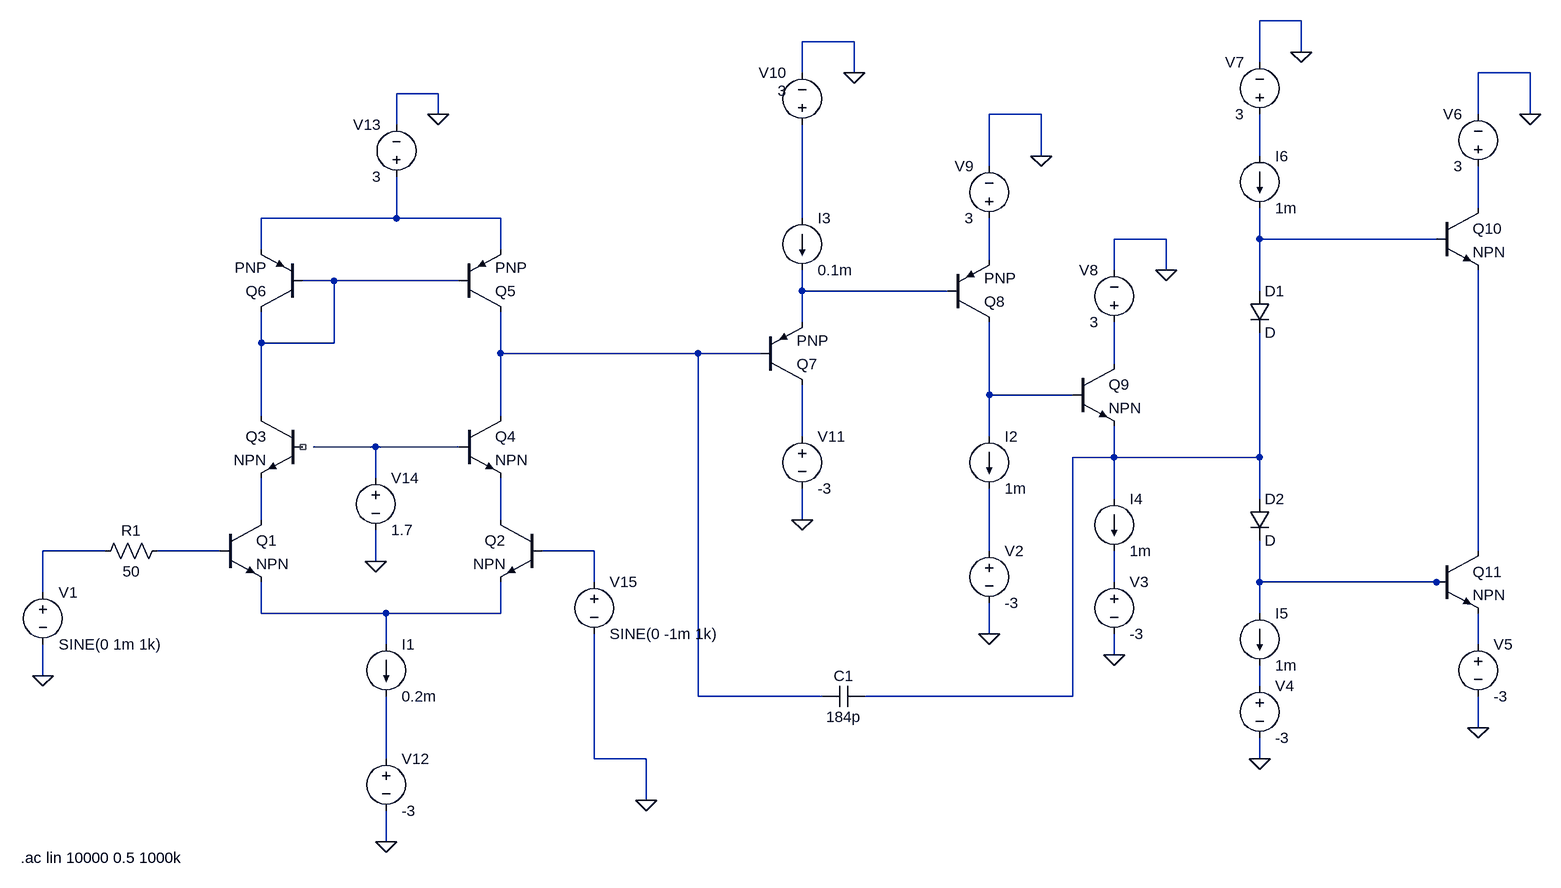
[diagram p0: schematic project.asc]
project.asc, the LTspice schematic file:
Version 4
SHEET 1 2212 680
WIRE 1680 -656 1616 -656
WIRE 992 -624 912 -624
WIRE 1680 -608 1680 -656
WIRE 1616 -592 1616 -656
WIRE 912 -576 912 -624
WIRE 992 -576 992 -624
WIRE 2032 -576 1952 -576
WIRE 352 -544 288 -544
WIRE 352 -512 352 -544
WIRE 1280 -512 1200 -512
WIRE 1952 -512 1952 -576
WIRE 2032 -512 2032 -576
WIRE 288 -496 288 -544
WIRE 1280 -448 1280 -512
WIRE 1616 -448 1616 -512
WIRE 1200 -432 1200 -512
WIRE 1952 -368 1952 -432
WIRE 288 -352 288 -416
WIRE 288 -352 80 -352
WIRE 448 -352 288 -352
WIRE 912 -352 912 -496
WIRE 1472 -320 1392 -320
WIRE 1616 -320 1616 -368
WIRE 1888 -320 1616 -320
WIRE 80 -304 80 -352
WIRE 448 -304 448 -352
WIRE 1200 -288 1200 -352
WIRE 1392 -272 1392 -320
WIRE 1472 -272 1472 -320
WIRE 192 -256 144 -256
WIRE 384 -256 192 -256
WIRE 912 -240 912 -272
WIRE 1136 -240 912 -240
WIRE 1616 -240 1616 -320
WIRE 912 -192 912 -240
WIRE 80 -160 80 -208
WIRE 192 -160 192 -256
WIRE 192 -160 80 -160
WIRE 448 -144 448 -208
WIRE 752 -144 448 -144
WIRE 848 -144 752 -144
WIRE 1392 -128 1392 -192
WIRE 1200 -80 1200 -192
WIRE 1328 -80 1200 -80
WIRE 80 -48 80 -160
WIRE 448 -48 448 -144
WIRE 912 -16 912 -96
WIRE 1200 -16 1200 -80
WIRE 256 0 160 0
WIRE 384 0 256 0
WIRE 1392 16 1392 -32
WIRE 1392 16 1328 16
WIRE 1616 16 1616 -176
WIRE 1616 16 1392 16
WIRE 256 48 256 0
WIRE 1392 80 1392 16
WIRE 1616 80 1616 16
WIRE 80 112 80 48
WIRE 448 112 448 48
WIRE 912 112 912 64
WIRE -160 160 -256 160
WIRE 16 160 -80 160
WIRE 592 160 512 160
WIRE 1200 160 1200 64
WIRE 1952 160 1952 -272
WIRE 256 176 256 128
WIRE 592 208 592 160
WIRE 1392 208 1392 160
WIRE 1616 208 1616 144
WIRE 1888 208 1616 208
WIRE 1904 208 1888 208
WIRE -256 224 -256 160
WIRE 80 256 80 208
WIRE 272 256 80 256
WIRE 448 256 448 208
WIRE 448 256 272 256
WIRE 1616 256 1616 208
WIRE 1200 288 1200 240
WIRE 272 304 272 256
WIRE 1952 304 1952 256
WIRE 1392 320 1392 288
WIRE -256 352 -256 304
WIRE 1616 368 1616 336
WIRE 752 384 752 -144
WIRE 944 384 752 384
WIRE 1328 384 1328 16
WIRE 1328 384 1008 384
WIRE 1952 432 1952 384
WIRE 272 480 272 384
WIRE 592 480 592 288
WIRE 672 480 592 480
WIRE 1616 480 1616 448
WIRE 672 544 672 480
WIRE 272 608 272 560
FLAG -256 352 0
FLAG 912 112 0
FLAG 1200 288 0
FLAG 1392 320 0
FLAG 1616 480 0
FLAG 1952 432 0
FLAG 2032 -512 0
FLAG 1680 -608 0
FLAG 1472 -272 0
FLAG 1280 -448 0
FLAG 992 -576 0
FLAG 352 -512 0
FLAG 272 608 0
FLAG 256 176 0
FLAG 672 544 0
SYMBOL npn 16 112 R0
SYMATTR InstName Q1
SYMBOL npn 512 112 M0
SYMATTR InstName Q2
SYMBOL npn 144 -48 M0
SYMATTR InstName Q3
SYMBOL npn 384 -48 R0
SYMATTR InstName Q4
SYMBOL pnp 384 -208 M180
SYMATTR InstName Q5
SYMBOL pnp 144 -208 R180
SYMATTR InstName Q6
SYMBOL pnp 848 -96 M180
SYMATTR InstName Q7
SYMBOL pnp 1136 -192 M180
SYMATTR InstName Q8
SYMBOL npn 1328 -128 R0
SYMATTR InstName Q9
SYMBOL diode 1600 -240 R0
SYMATTR InstName D1
SYMBOL diode 1600 80 R0
SYMATTR InstName D2
SYMBOL npn 1888 -368 R0
SYMATTR InstName Q10
SYMBOL npn 1888 160 R0
SYMATTR InstName Q11
SYMBOL res -64 144 R90
WINDOW 0 0 56 VBottom 2
WINDOW 3 32 56 VTop 2
SYMATTR InstName R1
SYMATTR Value 50
SYMBOL voltage -256 208 R0
WINDOW 123 0 0 Left 0
WINDOW 39 0 0 Left 0
SYMATTR InstName V1
SYMATTR Value SINE(0 1m 1k)
SYMBOL current 272 304 R0
WINDOW 123 0 0 Left 0
WINDOW 39 0 0 Left 0
SYMATTR InstName I1
SYMATTR Value 0.2m
SYMBOL current 1200 -16 R0
WINDOW 123 0 0 Left 0
WINDOW 39 0 0 Left 0
SYMATTR InstName I2
SYMATTR Value 1m
SYMBOL current 912 -352 R0
WINDOW 123 0 0 Left 0
WINDOW 39 0 0 Left 0
SYMATTR InstName I3
SYMATTR Value 0.1m
SYMBOL current 1392 80 R0
WINDOW 123 0 0 Left 0
WINDOW 39 0 0 Left 0
SYMATTR InstName I4
SYMATTR Value 1m
SYMBOL current 1616 256 R0
WINDOW 123 0 0 Left 0
WINDOW 39 0 0 Left 0
SYMATTR InstName I5
SYMATTR Value 1m
SYMBOL current 1616 -448 R0
WINDOW 123 0 0 Left 0
WINDOW 39 0 0 Left 0
SYMATTR InstName I6
SYMATTR Value 1m
SYMBOL voltage 1200 144 R0
WINDOW 123 0 0 Left 0
WINDOW 39 0 0 Left 0
SYMATTR InstName V2
SYMATTR Value -3
SYMBOL voltage 1392 192 R0
WINDOW 123 0 0 Left 0
WINDOW 39 0 0 Left 0
SYMATTR InstName V3
SYMATTR Value -3
SYMBOL voltage 1616 352 R0
WINDOW 123 0 0 Left 0
WINDOW 39 0 0 Left 0
SYMATTR InstName V4
SYMATTR Value -3
SYMBOL voltage 1952 288 R0
WINDOW 123 0 0 Left 0
WINDOW 39 0 0 Left 0
SYMATTR InstName V5
SYMATTR Value -3
SYMBOL voltage 1952 -416 R180
WINDOW 0 24 96 Left 2
WINDOW 3 24 16 Left 2
WINDOW 123 0 0 Left 0
WINDOW 39 0 0 Left 0
SYMATTR InstName V6
SYMATTR Value 3
SYMBOL voltage 1616 -496 R180
WINDOW 0 24 96 Left 2
WINDOW 3 24 16 Left 2
WINDOW 123 0 0 Left 0
WINDOW 39 0 0 Left 0
SYMATTR InstName V7
SYMATTR Value 3
SYMBOL voltage 1392 -176 R180
WINDOW 0 24 96 Left 2
WINDOW 3 24 16 Left 2
WINDOW 123 0 0 Left 0
WINDOW 39 0 0 Left 0
SYMATTR InstName V8
SYMATTR Value 3
SYMBOL voltage 1200 -336 R180
WINDOW 0 24 96 Left 2
WINDOW 3 24 16 Left 2
WINDOW 123 0 0 Left 0
WINDOW 39 0 0 Left 0
SYMATTR InstName V9
SYMATTR Value 3
SYMBOL voltage 912 -480 R180
WINDOW 0 24 96 Left 2
WINDOW 3 24 68 Left 2
WINDOW 123 0 0 Left 0
WINDOW 39 0 0 Left 0
SYMATTR InstName V10
SYMATTR Value 3
SYMBOL voltage 912 -32 R0
WINDOW 123 0 0 Left 0
WINDOW 39 0 0 Left 0
SYMATTR InstName V11
SYMATTR Value -3
SYMBOL voltage 272 464 R0
WINDOW 123 0 0 Left 0
WINDOW 39 0 0 Left 0
SYMATTR InstName V12
SYMATTR Value -3
SYMBOL voltage 288 -400 R180
WINDOW 0 24 96 Left 2
WINDOW 3 24 16 Left 2
WINDOW 123 0 0 Left 0
WINDOW 39 0 0 Left 0
SYMATTR InstName V13
SYMATTR Value 3
SYMBOL voltage 256 32 R0
WINDOW 123 0 0 Left 0
WINDOW 39 0 0 Left 0
SYMATTR InstName V14
SYMATTR Value 1.7
SYMBOL cap 1008 368 R90
WINDOW 0 0 32 VBottom 2
WINDOW 3 32 32 VTop 2
SYMATTR InstName C1
SYMATTR Value 184p
SYMBOL voltage 592 192 R0
WINDOW 123 0 0 Left 0
WINDOW 39 0 0 Left 0
SYMATTR InstName V15
SYMATTR Value SINE(0 -1m 1k)
TEXT -290 632 Left 2 !.ac lin 10000 0.5 1000k

The netlist it stands for:
* project.asc
Q1 N015 N018 N024 0 NPN
Q2 N016 N019 N024 0 NPN
Q3 N007 NC_01 N015 0 NPN
Q4 N009 N013 N016 0 NPN
Q5 N009 N007 N003 0 PNP
Q6 N007 N007 N003 0 PNP
Q7 N012 N009 N008 0 PNP
Q8 N011 N008 N006 0 PNP
Q9 N010 N011 N014 0 NPN
D1 N005 N014 D
D2 N014 N023 D
Q10 N002 N005 N021 0 NPN
Q11 N021 N023 N025 0 NPN
R1 N018 N017 50
V1 N017 0 SINE(0 1m 1k)
I1 N024 N027 0.2m
I2 N011 N020 1m
I3 N004 N008 0.1m
I4 N014 N022 1m
I5 N023 N026 1m
I6 N001 N005 1m
V2 N020 0 -3
V3 N022 0 -3
V4 N026 0 -3
V5 N025 0 -3
V6 N002 0 3
V7 N001 0 3
V8 N010 0 3
V9 N006 0 3
V10 N004 0 3
V11 N012 0 -3
V12 N027 0 -3
V13 N003 0 3
V14 N013 0 1.7
C1 N014 N009 184p
V15 N019 0 SINE(0 -1m 1k)
.model D D
.lib standard.dio
.model NPN NPN
.model PNP PNP
.lib standard.bjt
.ac lin 10000 0.5 1000k
.backanno
.end